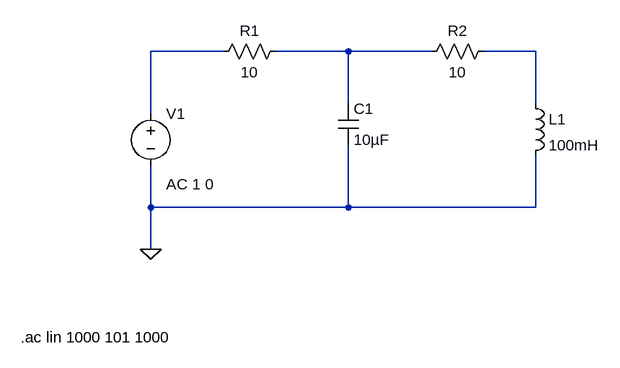
[diagram p0: schematic ser-para-freq-analysis.asc]
ser-para-freq-analysis.asc, the LTspice schematic file:
Version 4.1
SHEET 1 880 680
WIRE 96 96 -16 96
WIRE 288 96 176 96
WIRE 416 96 288 96
WIRE 576 96 496 96
WIRE 288 176 288 96
WIRE 576 176 576 96
WIRE -16 192 -16 96
WIRE -16 336 -16 272
WIRE 288 336 288 240
WIRE 288 336 -16 336
WIRE 576 336 576 256
WIRE 576 336 288 336
WIRE -16 400 -16 336
FLAG -16 400 0
SYMBOL res 192 80 R90
WINDOW 0 0 56 VBottom 2
WINDOW 3 32 56 VTop 2
SYMATTR InstName R1
SYMATTR Value 10
SYMBOL res 512 80 R90
WINDOW 0 0 56 VBottom 2
WINDOW 3 32 56 VTop 2
SYMATTR InstName R2
SYMATTR Value 10
SYMBOL cap 272 176 R0
SYMATTR InstName C1
SYMATTR Value 10µF
SYMBOL ind 560 160 R0
SYMATTR InstName L1
SYMATTR Value 100mH
SYMBOL voltage -16 176 R0
WINDOW 123 24 124 Left 2
WINDOW 39 0 0 Left 0
SYMATTR InstName V1
SYMATTR Value ""
SYMATTR Value2 AC 1 0
TEXT -216 536 Left 2 !.ac lin 1000 101 1000

The netlist it stands for:
* ser-para-freq-analysis.asc
R1 N002 N001 10
R2 N003 N002 10
C1 N002 0 10µF
L1 N003 0 100mH
V1 N001 0 AC 1 0
.ac lin 1000 101 1000
.backanno
.end